# EAGLE design mod_mixer_v0.3 (EAGLE 7.2.0)
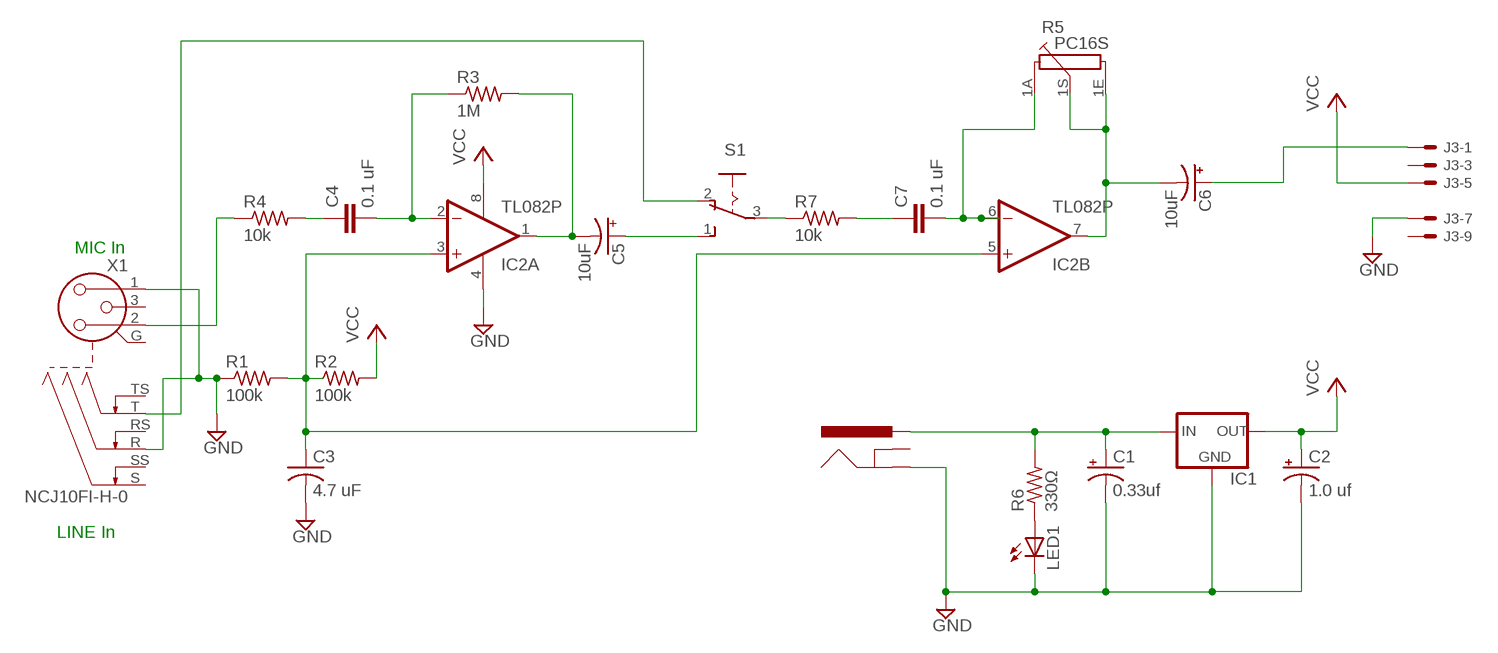
[diagram p0: schematic, sheet 1]

## Parts
C1  0.33uf  CPOL-USE2.5-6  [E2,5-6]
C2  1.0 uf  CPOL-USE2.5-6  [E2,5-6]
C3  4.7 uF  C-US050-030X075  [C050-030X075]
C4  0.1 uF  C5/2.5  [C5B2.5]
C5  10uF  CPOL-USE5-6  [E5-6]
C6  10uF  CPOL-USE2.5-7  [E2,5-7]
C7  0.1 uF  C5/2.5  [C5B2.5]
IC1  V_REG_78XXSIDE  [78XXL]
IC2  TL082P  [DIL08]
J1  POWER_JACKSLT  [POWER_JACK_SLOT]
J3  CON-50-EDGE  [CARDEDGE-50]
LED1  LEDSFH480  [SFH480]
R1  100k  R-US_0207/10  [0207/10]
R2  100k  R-US_0207/10  [0207/10]
R3  1M  R-US_0207/10  [0207/10]
R4  10k  R-US_0207/10  [0207/10]
R5  PC16S  [PC16S]
R6  330Ω  R-US_0207/10  [0207/10]
R7  10k  R-US_0207/10  [0207/10]
S1  255SB  [255SB]
X1  NCJ10FI-H-0  [NCJ10FI-H-0]

## Nets
GND: C1.- C2.- C3.2 IC1.GND IC2.4(P:V-) J1.GND@2(GND) J3.7 LED1.K(C) R1.1 X1.1 X1.R
N$1: C3.1 IC2.3(A:+IN) IC2.5(B:+IN) R1.2 R2.1
N$2: LED1.A R6.1
N$3: C7.1 R7.2
N$4: C4.2 IC2.2(A:-IN) R3.1
N$5: C7.2 IC2.6(B:-IN) R5.1A
N$7: C5.- IC2.1(A:OUT) R3.2
N$8: C6.+ J3.1
N$9: S1.2(O) X1.T
N$10: R4.1 X1.2
N$11: C5.+ S1.1(S)
N$12: C1.+ IC1.IN J1.PWR R6.2
N$13: C4.1 R4.2
N$14: R7.1 S1.3(P)
N$15: C6.- IC2.7(B:OUT) R5.1E R5.1S
VCC: C2.+ IC1.OUT IC2.8(P:V+) J3.5 R2.2
Unconnected: J1.GND@1(GNDBREAK) J3.3 J3.9 X1.3 X1.G X1.RS X1.S X1.SS X1.TS

## Notes on the sheet
- MIC In
- LINE In

## Library data of the parts
C1 C2 C5 C6 = rcl:CPOL-US: POLARIZED CAPACITOR, American symbol
C3 = resistor:C-US: CAPACITOR, American symbol
C4 C7 = capacitor-wima:C: CAPACITOR naming: grid - package width
IC1 = SparkFun:V_REG_78XX: Voltage Regulator Standard 7805 5V regulator. IGO (Input Ground Output). Spark Fun Electronics SKU : COM-00107
IC2 = linear:TL082: OP AMP Data sheet <http://www.ti.com/lit/ds/symlink/tl084a . pdf>; DATA_SHEET: <a href="http://www.ti.com/lit/ds/symlink/tl084a.pdf"> Data sheet </a>
J1 = SparkFun:POWER_JACK: Power Jack This is the standard 5.5mm barrel jack for power. The PTH is the most common, proven, reliable, footprint. All others are experimental. The Slot footprint only works if the mill layer is transmitted to the PCB fab house so be warned. Spark Fun Electronics SKU : PRT-00119. Mating wall wart : TOL-00298 (and others)
J3 = card-edge_5pin_b:CON-50: Connector 50-pin
LED1 = led:LED: LED OSRAM: - CHIPLED LG R971, LG N971, LY N971, LG Q971, LY Q971, LO R971, LY R971 LH N974, LH R974 LS Q976, LO Q976, LY Q976 LO Q996 - Hyper CHIPLED LW Q18S LB Q993, LB Q99A, LB R99A - SideLED LS A670, LO A670, LY A670, LG A670, LP A670 LB A673, LV A673, LT A673, LW A673 LH A674 LY A675 LS A676, LA A676, LO A676, LY A676, LW A676 LS A679, LY A679, LG A679 - Hyper Micro SIDELED® LS Y876, LA Y876, LO Y876, LY Y876 LT Y87S - SmartLED LW L88C, LW L88S LB L89C, LB L89S, LG L890 LS L89K, LO L89K, LY L89K LS L896, LA L896, LO L896, LY L896 - TOPLED LS T670, LO T670, LY T670, LG T670, LP T670 LSG T670, LSP T670, LSY T670, LOP T670, LYG T670 LG T671, LOG T671, LSG T671 LB T673, LV T673, LT T673, LW T673 LH T674 LS T676, LA T676, LO T676, LY T676, LB T676, LH T676, LSB T676, LW T676 LB T67C, LV T67C, LT T67C, LS T67K, LO T67K, LY T67K, LW E67C LS E67B, LA E67B, LO E67B, LY E67B, LB E67C, LV E67C, LT E67C LW T67C LS T679, LY T679, LG T679 LS T770, LO T770, LY T770, LG T770, LP T770 LB T773, LV T773, LT T773, LW T773 LH T774 LS E675, LA E675, LY E675, LS T675 LS T776, LA T776, LO T776, LY T776, LB T776 LHGB T686 LT T68C, LB T68C - Hyper Mini TOPLED® LB M676 - Mini TOPLED Santana® LG M470 LS M47K, LO M47K, LY M47K Source: http://www.osram.convergy.de LUXEON: - LUMILED® LXK2-PW12-R00, LXK2-PW12-S00, LXK2-PW14-U00, LXK2-PW14-V00 LXK2-PM12-R00, LXK2-PM12-S00, LXK2-PM14-U00 LXK2-PE12-Q00, LXK2-PE12-R00, LXK2-PE12-S00, LXK2-PE14-T00, LXK2-PE14-U00 LXK2-PB12-K00, LXK2-PB12-L00, LXK2-PB12-M00, LXK2-PB14-N00, LXK2-PB14-P00, LXK2-PB14-Q00 LXK2-PR12-L00, LXK2-PR12-M00, LXK2-PR14-Q00, LXK2-PR14-R00 LXK2-PD12-Q00, LXK2-PD12-R00, LXK2-PD12-S00 LXK2-PH12-R00, LXK2-PH12-S00 LXK2-PL12-P00, LXK2-PL12-Q00, LXK2-PL12-R00 Source: www.luxeon.com KINGBRIGHT: KA-3528ASYC Source: www.kingbright.com
R1-R4 R6 R7 = resistor:R-US_: RESISTOR, American symbol
R5 = piherUPDATE:PC16S: POTENTIOMETER single carbon potentiometer, 16 mm, S3ROH; OC_FARNELL: 4452940; OC_NEWARK: unknown
S1 = switchUPDATE:255SB: SLIDING SWITCH Distributor Buerklin, 11G810
X1 = con-neutrik_ag:NCJ10FI-: Neutrik Audio Connector XLR SERIES Stereo 1/4" jack with switch Source: www.neutrik.com/; MPN: NCJ10FI-H-0; OC_FARNELL: unknown; OC_NEWARK: 99B1398

## Board
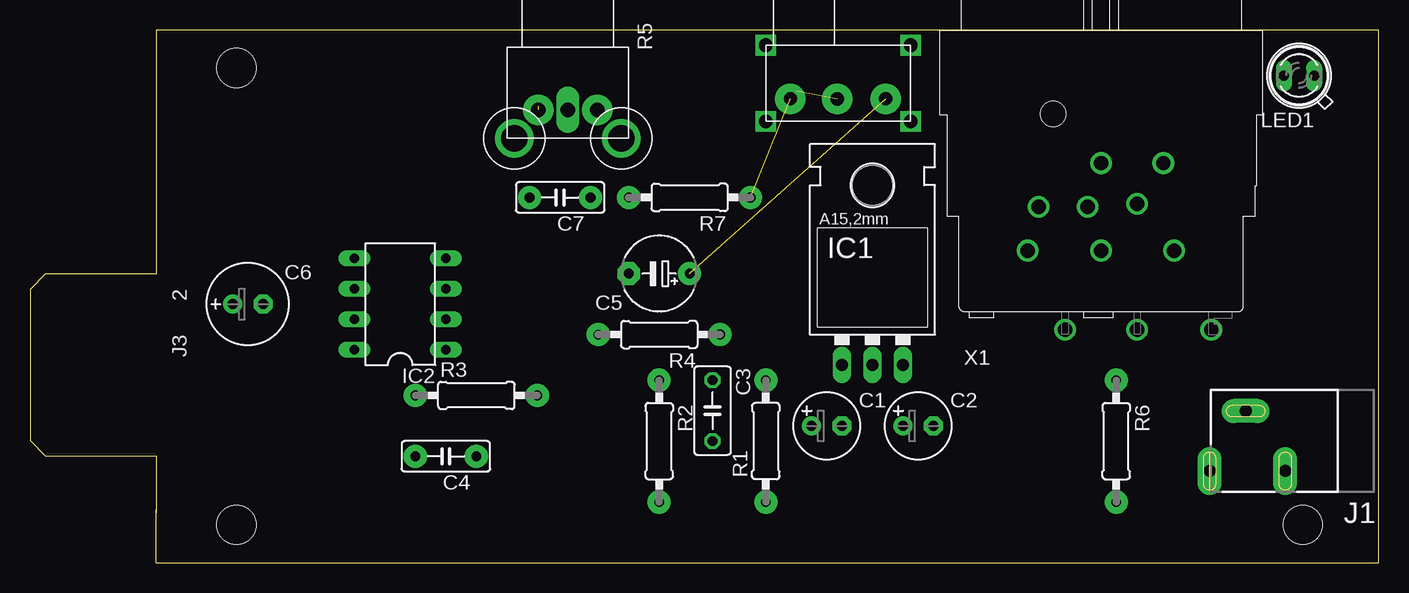
[diagram p1: board, top side]
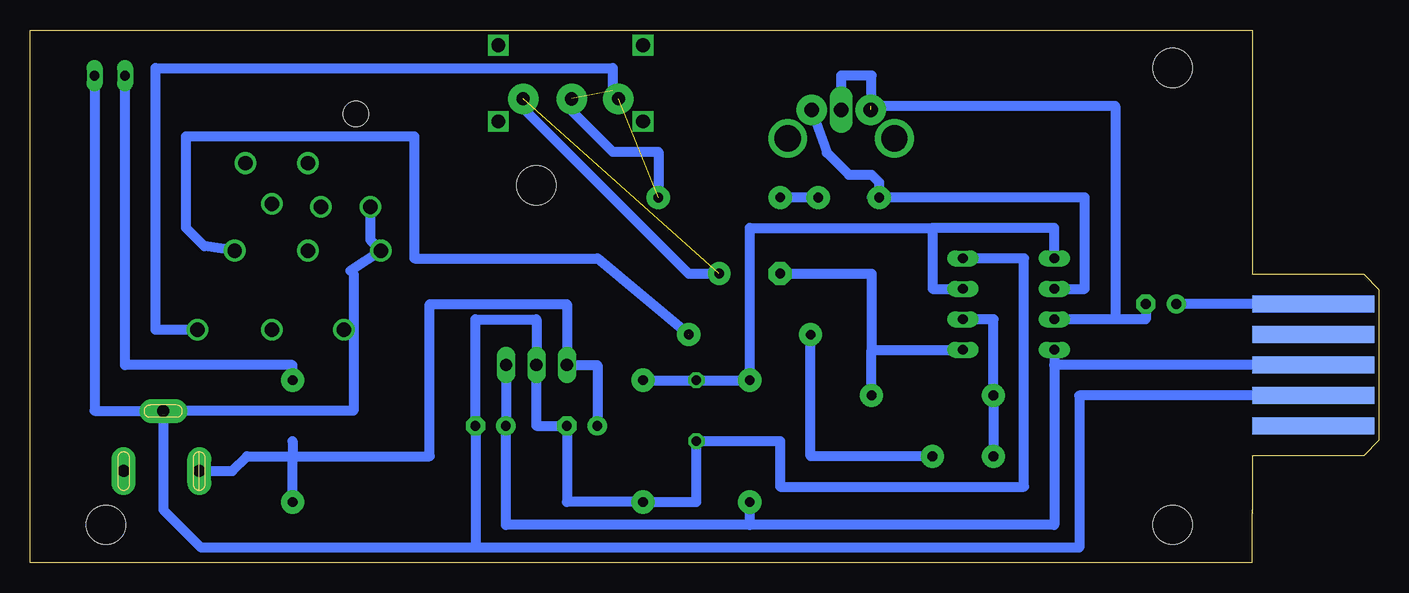
[diagram p2: board, bottom side, seen from below]

Size 112.45 x 44.45 mm. Coordinates in mm from the lower left corner, seen from the top.
Outline: 10.54,44.44 112.45,44.44 112.45,0 10.54,0 10.54,4.45
Outline: 10.54,44.45 10.54,27.3
Copper layers (1*16): Top 0.035mm / dielectric 1.5mm / Bottom 0.035mm
Design rules "default": minimum track width 10mil, minimum drill 24mil, track to track 8mil, track to pad 8mil, pad to pad 8mil, via to via 8mil, smd to smd 8mil, copper to edge 40mil, drill to drill 8mil, minimum pad ring 10mil, minimum via ring 8mil, stop-mask expansion 4mil, vias tented up to drill 0mil, thermal gap 10mil
Holes 3.26 mm at 106.11,3.17 17.21,3.17 17.21,41.27

### Footprints (pad centres in the part's own frame; a part is rotated, then mirrored left to right if it is on the bottom)
E2,5-6 = drill 0.813 pad 1.6: + -1.27,0 | drill 0.813 pad 1.6 octagon: - 1.27,0
C050-030X075 = drill 0.813 octagon: 1 -2.54,0; 2 2.54,0
C5B2.5 = drill 0.813 pad 1.93: 1 -2.54,0; 2 2.54,0
E5-6 = drill 0.813 pad 1.905: + -2.54,0 | drill 0.813 pad 1.905 octagon: - 2.54,0
E2,5-7 = drill 0.813 pad 1.6: + -1.27,0 | drill 0.813 pad 1.6 octagon: - 1.27,0
78XXL = drill 1.016 long: GND 0,-3.81; IN -2.54,-3.81; OUT 2.54,-3.81 | hole 3.302: 0,11.176
DIL08 = drill 0.813 pad 1.27 long: 1 -3.81,-3.81; 2 -1.27,-3.81; 3 1.27,-3.81; 4 3.81,-3.81; 5 3.81,3.81; 6 1.27,3.81; 7 -1.27,3.81; 8 -3.81,3.81
POWER_JACK_SLOT = drill 1 pad 2 long: GND@1 2.58,7.5; GND@2 7.58,10.8; PWR 2.58,13.8
CARDEDGE-50 = smd 1.397 x 10.16 bottom: 1 -30.48,5.08; 3 -27.94,5.08; 5 -25.4,5.08; 7 -22.86,5.08; 9 -20.32,5.08
SFH480 = drill 0.813 long: A 1.27,0; K -1.27,0
0207/10 = drill 0.813 pad 1.93: 1 -5.08,0 | drill 0.8 pad 1.93: 2 5.08,0
PC16S = drill 1.2 pad 2.54: 1A 5,-7.77; 1E 0.08,-7.77 | drill 1.2 pad 1.93 long: 1S 2.54,-7.77 | drill 2.2 pad 3.175: P$1 6.985,-10.16; P$2 -1.905,-10.16
255SB = drill 1.1 pad 2.54: 1 3.01,-0.658; 2 -1.033,-0.663; 3 -4.939,-0.66 | drill 1.143 square: P$1 5.08,-2.54; P$2 -6.985,-2.54; P$5 5.08,3.81; P$6 -6.985,3.81
NCJ10FI-H-0 = drill 1.2: 1 -6.1,-18.4; 2 6.1,-18.4; 3 0,-18.4; G 0,-11.1; GN -1.1,-14.75; R -5.2,-14.75; RS -3,-25; S 5.2,-11.1; SS 3,-14.5; T 9.2,-25; TS 3,-25 | hole 2.1: -4,-7

### Placement (x,y rotation side)
C1  66.42,11.43 0 top
C2  74.04,11.43 0 top
C3  56.9,12.7 270 top
C4  34.67,8.89 180 top
C5  52.45,24.13 180 top
C6  18.16,21.59 0 top
C7  44.2,30.48 180 top
IC1  70.23,20.32 0 top
IC2  30.86,21.59 90 top
J1  112.14,5.08 90 top
J3  0.38,-8.89 270 top
LED1  105.79,40.64 180 top
R1  61.34,10.16 90 top
R2  52.45,10.16 270 top
R3  37.21,13.97 0 top
R4  52.45,19.05 180 top
R5  42.29,45.57 0 top
R6  90.55,10.16 270 top
R7  54.99,30.48 180 top
S1  68.33,39.37 0 top
X1  89.28,44.45 0 top

### Tracks (layer width: path | path; a pad name or v marks a point on that pad's centre or on a via)
GND
  Bottom 0.813: X1.R 84.08,26.95 X1.1 85.72,24.38 85.47,24.13 85.47,12.7 97.49,12.7 100.71,12.67 | IC2.4 29.59,25.4 29.59,6.35 49.91,6.35 49.91,10.16 C3.2 56.9,5.08 R1.1 67.69,5.08 C1.- 70.23,11.43 IC1.GND 70.23,20.32 75.31,20.32 C2.- 75.31,1.27 | 75.31,1.27 24.99,1.27 24.99,13.97 J3.7 | 75.31,1.27 98.17,1.27 101.34,4.44 J1.GND@2 100.71,12.67 | 100.71,12.67 100.71,12.7 107.06,12.7 LED1.K
N$1
  Bottom 0.813: R1.2 C3.1 R2.1 52.45,27.94 37.21,27.94 | IC2.5 27.05,27.94 37.21,27.94 | IC2.3 37.21,22.86 37.21,27.94
N$2
  Bottom 0.813: R6.1 90.55,16.51 104.52,16.51 LED1.A
N$3
  Bottom 0.813: C7.1 R7.2
N$4
  Bottom 0.813: IC2.2 32.13,20.32 R3.1 C4.2
N$5
  Bottom 0.813: IC2.6 24.51,22.86 24.51,30.48 C7.2 | 42.29,30.48 C7.2 | R5.1A 46.02,34.21 44.2,32.38 42.29,32.38 41.66,31.75 C7.2
N$7
  Bottom 0.813: R3.2 42.29,17.78 | 42.29,17.78 IC2.1 | C5.- 42.29,24.13 42.29,17.78
N$8
  Bottom 0.813: J3.1 C6.+
N$9  (1 unrouted)
  Bottom 0.813: X1.T 101.98,19.45 101.98,41.27 63.88,41.27 63.88,39.37
N$10  (1 unrouted)
  Bottom 0.813: X1.2 97.92,26.42 99.44,27.94 99.44,35.56 80.39,35.56 80.39,25.4 65.15,25.4 R4.1
N$11  (1 unrouted)
  Bottom 0.813: 71.5,38.1 57.53,24.13 C5.+
N$12
  Bottom 0.813: J1.PWR 95.59,7.66 94.36,8.89 90.55,8.89 | 90.55,8.89 79.12,8.89 79.12,21.59 67.69,21.59 IC1.IN 65.15,16.51 C1.+ | R6.2 90.55,8.89 | 90.55,10.16 90.55,8.89
N$13
  Bottom 0.813: C4.1 47.37,8.89 R4.2
N$14  (1 unrouted)
  Bottom 0.813: 67.69,38.1 63.88,34.29 60.07,34.29 R7.1
N$15  (1 unrouted)
  Bottom 0.813: 42.37,38.1 21.97,38.1 21.97,20.32 | C6.- 19.43,20.32 21.97,20.32 | 21.97,20.32 IC2.7 | R5.1E 42.29,37.8 42.29,40.64 44.83,40.64 R5.1S
VCC
  Bottom 0.813: IC1.OUT C2.+ 72.77,3.17 52.45,3.17 | IC2.8 27.05,16.51 | 27.05,16.51 27.05,3.17 52.45,3.17 | R2.2 52.45,3.17 | J3.5 27.05,16.51